# Altium project Clase6_Multichanell.PrjPcb
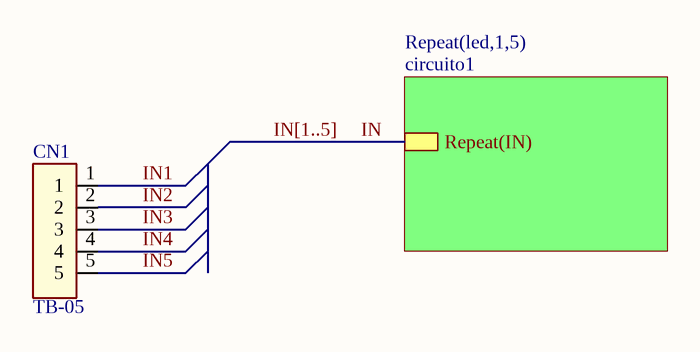
[diagram p0: Sheet1.SchDoc]
2 sheets, 11 parts. Net scope: hierarchical (ports join the sheet entries above them; power ports are global).
Board file: PCB3.PcbDoc
Sheets:
  Sheet1.SchDoc
    led1 = circuito1.SchDoc
    led2 = circuito1.SchDoc
    led3 = circuito1.SchDoc
    led4 = circuito1.SchDoc
    led5 = circuito1.SchDoc

## Sheet Sheet1.SchDoc
size A4; SheetNumber: 1; SheetTotal: 2

### Parts
CN1  TB-05  [TB508-05]

### Sub-sheets
Repeat(led,1,5) = circuito1: Repeat(IN)

### Nets
IN: sheet Repeat(led,1,5)/Repeat(IN)
IN1: CN1.1
IN2: CN1.2
IN3: CN1.3
IN4: CN1.4
IN5: CN1.5

### Buses and harness runs
bus IN[1..5]

### Library data of the parts
CN1 = TB-05: Terminal Block; Manufacturer: *; Part number: *; Unit price: *; Value: TB-05

## Sheet circuito1.SchDoc
size A4; SheetNumber: 2; SheetTotal: 2
Used 5 times, as channels led1, led2, led3, led4, led5. Parts and nets are listed once, with the designators drawn on the sheet.
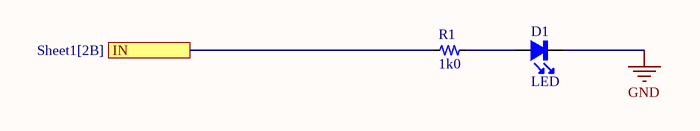
[diagram p1: circuito1.SchDoc]

### Parts
D1  LED  [LED-0805]
R1  1k0  [R2512]

### Ports
IN (see Sheet1[2B])

### Nets
GND: D1.1
IN: R1.1 ; port IN
NetD1_2: D1.2 R1.2

### Channels
led1: designators end in _led1; ports IN=IN1
led2: designators end in _led2; ports IN=IN2
led3: designators end in _led3; ports IN=IN3
led4: designators end in _led4; ports IN=IN4
led5: designators end in _led5; ports IN=IN5

### Library data of the parts
D1 = LED: LED - Light-Emitting Diode; Manufacturer: *; Part number: *; Unit price: *; Value: LED
R1 = Resistor: Single resistor; Power: 0.125W; Manufacturer: *; Part number: *; Value: 1k0; Unit price: 0.1

## Nets that join several sheets
GND: led1 (D1_led1.1), led2 (D1_led2.1), led3 (D1_led3.1), led4 (D1_led4.1), led5 (D1_led5.1)
IN1: Sheet1 (CN1.1), led1 (R1_led1.1)
IN2: Sheet1 (CN1.2), led2 (R1_led2.1)
IN3: Sheet1 (CN1.3), led3 (R1_led3.1)
IN4: Sheet1 (CN1.4), led4 (R1_led4.1)
IN5: Sheet1 (CN1.5), led5 (R1_led5.1)